# EAGLE design v2164_quad_VCA_0402 (EAGLE 7.7.0)
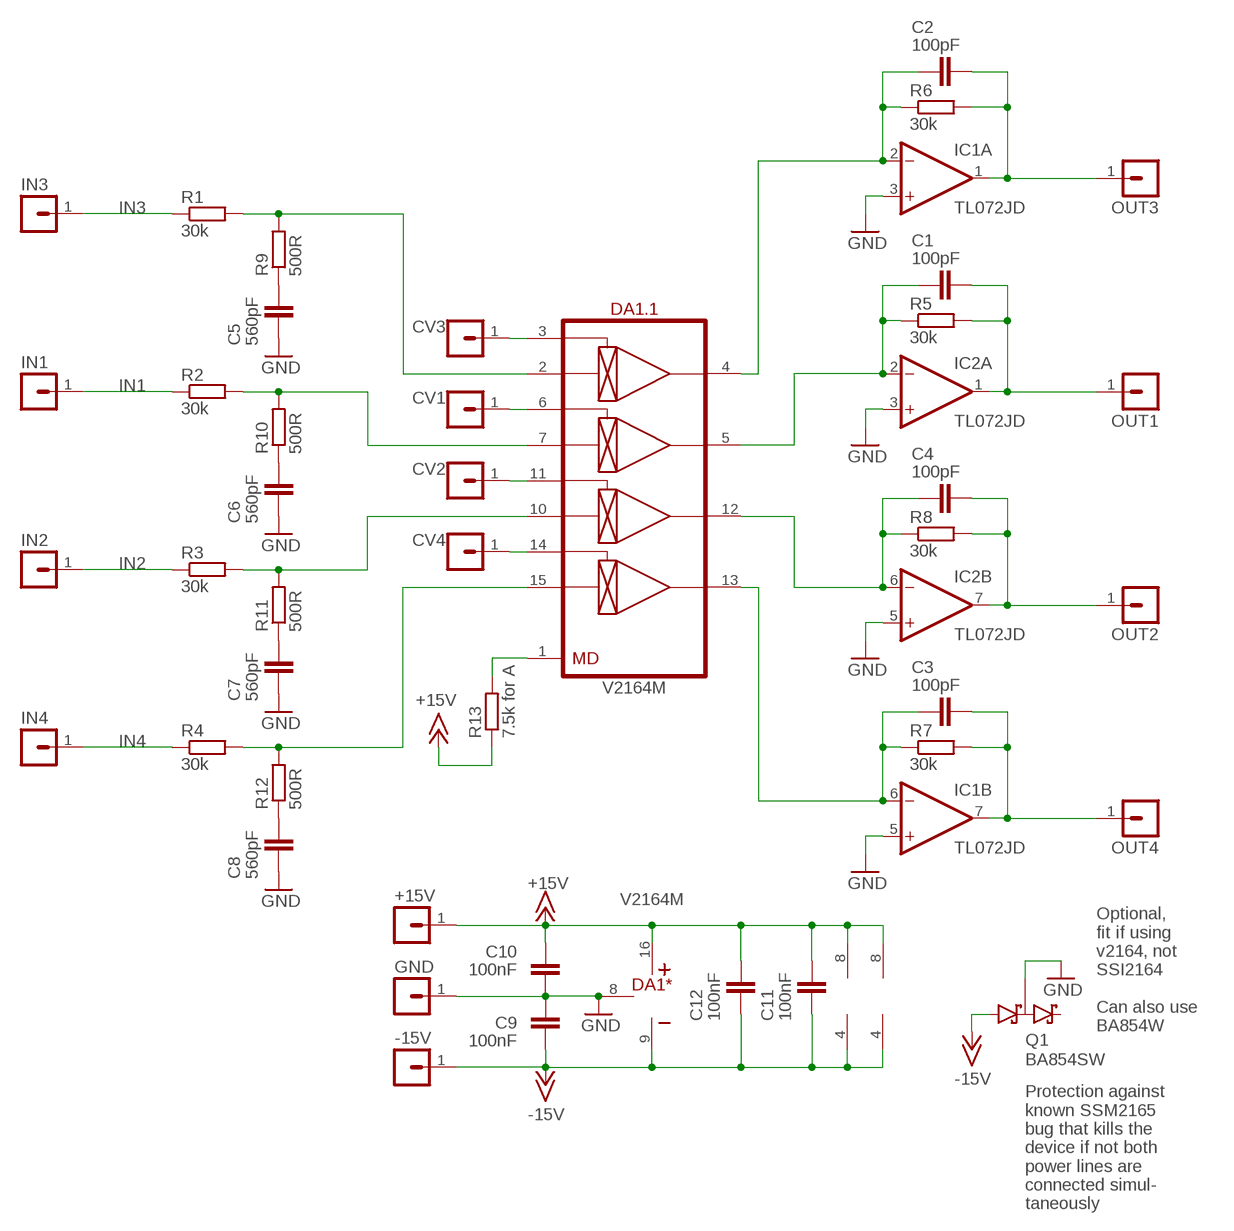
[diagram p0: schematic, sheet 1]

## Parts
+15V  MA01-1JN  [MA01N-1J]
-15V  MA01-1JN  [MA01N-1J]
C1  100pF  C-EUC0402  [C0402]
C2  100pF  C-EUC0402  [C0402]
C3  100pF  C-EUC0402  [C0402]
C4  100pF  C-EUC0402  [C0402]
C5  560pF  C-EUC0603  [C0603]
C6  560pF  C-EUC0603  [C0603]
C7  560pF  C-EUC0603  [C0603]
C8  560pF  C-EUC0603  [C0603]
C9  100nF  C-EUC0402  [C0402]
C10  100nF  C-EUC0402  [C0402]
C11  100nF  C-EUC0402  [C0402]
C12  100nF  C-EUC0402  [C0402]
CV1  MA01-1JN  [MA01N-1J]
CV2  MA01-1JN  [MA01N-1J]
CV3  MA01-1JN  [MA01N-1J]
CV4  MA01-1JN  [MA01N-1J]
DA1  V2164M  [SO-16]
GND  MA01-1JN  [MA01N-1J]
IC1  TL072JD  [SO08J]
IC2  TL072JD  [SO08J]
IN1  MA01-1JN  [MA01N-1J]
IN2  MA01-1JN  [MA01N-1J]
IN3  MA01-1JN  [MA01N-1J]
IN4  MA01-1JN  [MA01N-1J]
OUT1  MA01-1JN  [MA01N-1J]
OUT2  MA01-1JN  [MA01N-1J]
OUT3  MA01-1JN  [MA01N-1J]
OUT4  MA01-1JN  [MA01N-1J]
Q1  BA854SW  [SOT23-3J]
R1  30k  R-EU_R0402  [R0402]
R2  30k  R-EU_R0402  [R0402]
R3  30k  R-EU_R0402  [R0402]
R4  30k  R-EU_R0402  [R0402]
R5  30k  R-EU_R0402  [R0402]
R6  30k  R-EU_R0402  [R0402]
R7  30k  R-EU_R0402  [R0402]
R8  30k  R-EU_R0402  [R0402]
R9  500R  R-EU_R0402  [R0402]
R10  500R  R-EU_R0402  [R0402]
R11  500R  R-EU_R0402  [R0402]
R12  500R  R-EU_R0402  [R0402]
R13  7.5k for A  R-EU_R0402  [R0402]

## Nets
+15V: +15V.1 C10.2 C11.2 C12.2 DA1.16(*:V+) IC1.8(P:V+) IC2.8(P:V+) R13.1
-15V: -15V.1 C9.1 C11.1 C12.1 DA1.9(*:V-) IC1.4(P:V-) IC2.4(P:V-) Q1.1(A1)
CV1: CV1.1 DA1.6(.1:CV2)
CV2: CV2.1 DA1.11(.1:CV3)
CV3: CV3.1 DA1.3(.1:CV1)
CV4: CV4.1 DA1.14(.1:CV4)
GND: C5.1 C6.1 C7.1 C8.1 C9.2 C10.1 DA1.8(*:GND) GND.1 IC1.3(A:+IN) IC1.5(B:+IN) IC2.3(A:+IN) IC2.5(B:+IN) Q1.3(K1A2)
IN1: IN1.1 R2.1
IN2: IN2.1 R3.1
IN3: IN3.1 R1.1
IN4: IN4.1 R4.1
N$1: C4.1 DA1.12(.1:OUT3) IC2.6(B:-IN) R8.1
N$2: DA1.1(.1:MD) R13.2
N$3: C3.1 DA1.13(.1:OUT4) IC1.6(B:-IN) R7.1
N$5: C2.1 DA1.4(.1:OUT1) IC1.2(A:-IN) R6.1
N$7: C1.1 DA1.5(.1:OUT2) IC2.2(A:-IN) R5.1
N$9: C5.2 R9.1
N$10: C6.2 R10.1
N$11: C7.2 R11.1
N$12: C8.2 R12.1
N$17: DA1.2(.1:IN1) R1.2 R9.2
N$18: DA1.7(.1:IN2) R2.2 R10.2
N$19: DA1.10(.1:IN3) R3.2 R11.2
N$20: DA1.15(.1:IN4) R4.2 R12.2
OUT1: C1.2 IC2.1(A:OUT) OUT1.1 R5.2
OUT2: C4.2 IC2.7(B:OUT) OUT2.1 R8.2
OUT3: C2.2 IC1.1(A:OUT) OUT3.1 R6.2
OUT4: C3.2 IC1.7(B:OUT) OUT4.1 R7.2
Unconnected: Q1.2(K2)

## Notes on the sheet
- Optional,
  fit if using
  v2164, not
  SSI2164
  
  Can also use
  BA854W
- Protection against
  known SSM2165
  bug that kills the
  device if not both
  power lines are 
  connected simul-
  taneously

## Library data of the parts
+15V -15V CV1-CV4 GND IN1-IN4 OUT1-OUT4 = joakim:MA01-1J: PIN HEADER
C1-C12 = rcl:C-EU: CAPACITOR, European symbol; SPICEPREFIX: C
DA1 = ic-coolaudio:V2164
IC1 IC2 = joakim:TL072J: OP AMP
Q1 = joakim:BA854SW: Shottky barrier dual diode
R1-R13 = rcl:R-EU_: RESISTOR, European symbol; SPICEPREFIX: R

## Board
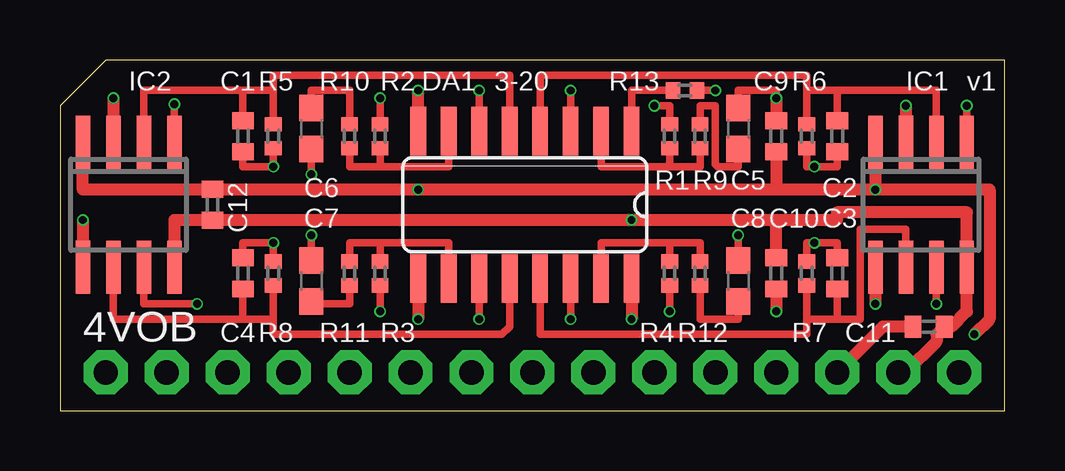
[diagram p1: board, top side]
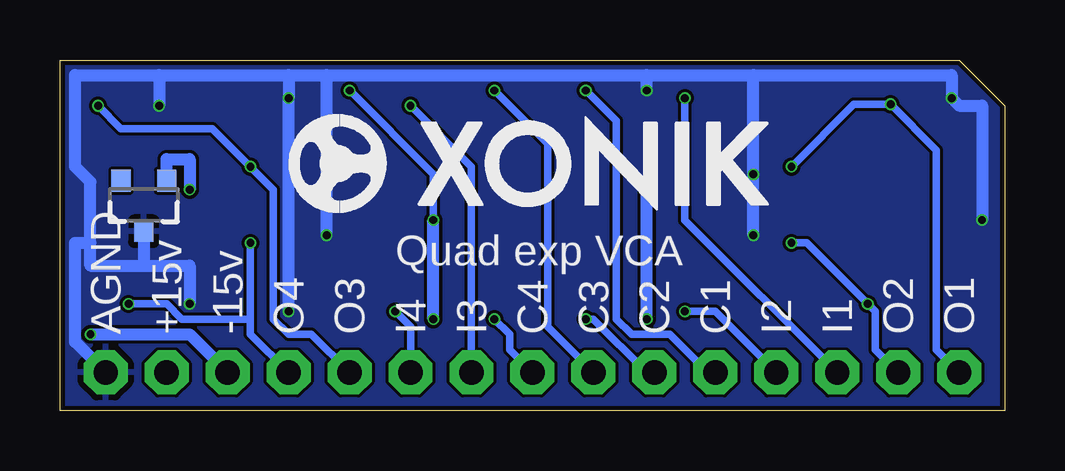
[diagram p2: board, bottom side, seen from below]

Size 39.37 x 14.61 mm. Coordinates in mm from the lower left corner, seen from the top.
Outline: 0,0 39.37,0 39.37,14.61 1.91,14.61 0,12.7 0,0
Copper layers (1*16): Top 0.035mm / dielectric 1.6mm / Bottom 0.035mm
Design rules "jlcpcb-2layers": minimum track width 5mil, minimum drill 0.3mm, track to track 5mil, track to pad 5mil, pad to pad 5mil, via to via 5mil, smd to smd 5mil, copper to edge 0.2mm, drill to drill 6mil, minimum pad ring 10mil, minimum via ring 3mil, stop-mask expansion 4mil, vias tented up to drill 0mil, thermal gap 10mil

### Footprints (pad centres in the part's own frame; a part is rotated, then mirrored left to right if it is on the bottom)
MA01N-1J = drill 1.016 octagon: 1 0,0
C0402 = smd 0.7 x 0.9: 1 -0.65,0; 2 0.65,0
C0603 = smd 1.1 x 1: 1 -0.85,0; 2 0.85,0
SO-16 = smd 0.66 x 2.032: 1 -4.445,-3.073; 2 -3.175,-3.073; 3 -1.905,-3.073; 4 -0.635,-3.073; 5 0.635,-3.073; 6 1.905,-3.073; 7 3.175,-3.073; 8 4.445,-3.073; 9 4.445,3.073; 10 3.175,3.073; 11 1.905,3.073; 12 0.635,3.073; 13 -0.635,3.073; 14 -1.905,3.073; 15 -3.175,3.073; 16 -4.445,3.073
SO08J = smd 0.6 x 2.2: 1 -1.905,-2.6; 2 -0.635,-2.6; 3 0.635,-2.6; 4 1.905,-2.6; 5 1.905,2.6; 6 0.635,2.6; 7 -0.635,2.6; 8 -1.905,2.6
SOT23-3J = smd 0.8 x 0.9: 1 -0.95,-1; 2 0.95,-1; 3 0,1.1
R0402 = smd 0.6 x 0.7: 1 -0.5,0; 2 0.5,0

### Placement (x,y rotation side)
+15V  34.92,1.59 90 top
-15V  32.38,1.59 90 top
C1  7.62,11.43 270 top
C2  32.38,11.43 270 top
C3  32.38,5.71 90 top
C4  7.62,5.71 90 top
C5  28.26,11.75 270 top
C6  10.48,11.75 90 top
C7  10.48,5.4 270 top
C8  28.26,5.4 270 top
C9  29.84,11.43 90 top
C10  29.84,5.71 90 top
C11  36.2,3.49 0 top
C12  6.35,8.57 270 top
CV1  12.06,1.59 90 top
CV2  14.61,1.59 90 top
CV3  17.14,1.59 90 top
CV4  19.68,1.59 90 top
DA1  19.37,8.57 180 top
GND  37.47,1.59 90 top
IC1  35.88,8.57 180 top
IC2  2.86,8.57 180 top
IN1  6.99,1.59 90 top
IN2  9.53,1.59 90 top
IN3  22.23,1.59 90 top
IN4  24.77,1.59 90 top
OUT1  1.91,1.59 90 top
OUT2  4.45,1.59 90 top
OUT3  27.3,1.59 90 top
OUT4  29.84,1.59 90 top
Q1  35.88,8.57 180 bottom
R1  25.4,11.43 270 top
R2  13.34,11.43 270 top
R3  13.34,5.71 90 top
R4  25.4,5.71 90 top
R5  8.89,11.43 270 top
R6  31.11,11.43 270 top
R7  31.11,5.71 90 top
R8  8.89,5.71 90 top
R9  26.67,11.43 270 top
R10  12.06,11.43 270 top
R11  12.06,5.71 90 top
R12  26.67,5.71 90 top
R13  26.04,13.34 180 top
U$1  [XONIK_LOGO_20]  29.84,8.26 0 bottom

### Tracks (layer width: path | path; a pad name or v marks a point on that pad's centre or on a via)
+15V  (via drill 0.33)
  Top 0.305: R13.1 v27.3,13.34
  Top 0.508: IC2.8 4.76,7.94 6.35,7.94 | 29.84,7.94 32.38,7.94 32.38,8.26 37.78,8.26 IC1.8 37.78,4.13 37.15,3.49 C11.2 36.53,3.17 36.53,2.87 35.24,1.59 +15V.1 | 29.84,7.94 v23.81,7.94 6.35,7.94 | C12.2 6.35,7.94 | C10.2 29.84,7.94 | DA1.16 v23.81,3.81
  Bottom 0.305: v27.3,13.34 23.81,9.84 v23.81,7.94
  Bottom 0.508: v23.81,3.81 v23.81,7.94
-15V  (via drill 0.33)
  Top 0.508: IC1.4 v33.97,9.21 | IC2.4 0.95,9.21 6.35,9.21 | v33.97,9.21 29.84,9.21 | 29.84,9.21 v14.92,9.21 6.35,9.21 | DA1.9 v14.92,3.81 | C12.1 6.35,9.21 | C9.1 29.84,9.21 | C11.1 34.29,3.49 -15V.1 | v38.1,3.17 38.73,3.81 38.73,9.21 v33.97,9.21
  Bottom 0.508: v14.92,3.81 v14.92,9.21 | v38.1,3.17 33.97,3.17 -15V.1 | Q1.1 34.92,10.48 33.97,10.48 v33.97,9.21
CV1  (via drill 0.33)
  Top 0.305: DA1.6 v17.46,13.34
  Bottom 0.305: v17.46,13.34 16.19,12.06 16.19,3.81 15.56,3.17 13.97,3.17 12.38,1.59 CV1.1
CV2  (via drill 0.33)
  Top 0.305: DA1.11 v17.46,3.81
  Bottom 0.305: v17.46,3.81 17.14,3.81 14.92,1.59 CV2.1
CV3  (via drill 0.33)
  Top 0.305: DA1.3 v21.27,13.34
  Bottom 0.305: v21.27,13.34 19.05,11.11 19.05,3.49 CV3.1
CV4  (via drill 0.33)
  Top 0.305: DA1.14 v21.27,3.81
  Bottom 0.305: v21.27,3.81 20.64,3.17 20.64,2.54 CV4.1
GND  (via drill 0.33)
  Top 0.305: C6.1 v10.48,9.84 | C7.1 v10.48,7.3 | C8.1 v28.26,7.3 | C5.1 28.26,13.34 29.84,13.34 v29.84,13.02
  Top 0.508: DA1.8 v14.92,13.34 | v29.84,13.02 C9.2 | C10.1 v29.84,4.13 | v35.24,12.7 IC1.3 | IC1.5 v33.97,4.45 | v2.22,13.02 IC2.3 | v0.95,7.94 IC2.5
  Bottom 0.508: 35.24,13.97 38.73,13.97 38.73,10.16 38.1,9.53 38.1,6.99 | 35.24,13.97 29.84,13.97 | 29.84,13.97 28.26,13.97 | 28.26,13.97 14.92,13.97 | 14.92,13.97 10.48,13.97 | 10.48,13.97 2.22,13.97 v2.22,13.02 1.91,12.7 0.95,12.7 v0.95,7.94 | v14.92,13.34 14.92,13.97 | 29.84,13.97 v29.84,13.02 v29.84,4.13 | 35.24,13.97 v35.24,12.7 | 10.48,13.97 v10.48,9.84 v10.48,7.3 | v28.26,7.3 28.26,13.97 | 35.88,6.03 38.1,6.03 38.1,6.99 | 35.88,6.03 33.97,6.03 v33.97,4.45 | GND.1 38.73,2.86 38.73,6.99 38.1,6.99 | Q1.3 35.88,6.03
  pour Bottom: 0,0 0,14.61 39.37,14.61 39.37,0
IN1  (via drill 0.33)
  Top 0.305: R2.1 v13.34,13.02
  Bottom 0.305: v13.34,13.02 13.34,7.94 IN1.1
IN2  (via drill 0.33)
  Top 0.305: R3.1 v13.34,4.13
  Bottom 0.305: v13.34,4.13 12.06,4.13 IN2.1
IN3  (via drill 0.33)
  Top 0.305: v24.77,12.7 25.4,12.7 R1.1
  Bottom 0.305: v24.77,12.7 22.23,10.16 IN3.1
IN4  (via drill 0.33)
  Top 0.305: v25.4,4.13 R4.1
  Bottom 0.305: v25.4,4.13 24.77,3.49 IN4.1
N$1
  Top 0.305: R8.1 8.89,3.81 | 8.89,3.81 7.62,3.81 | C4.1 7.62,3.81 | IC2.6 2.22,3.81 7.62,3.81 | DA1.12 18.73,3.49 18.41,3.17 8.89,3.17 8.89,3.81
N$2
  Top 0.305: R13.2 23.81,13.34 DA1.1
N$3
  Top 0.305: R7.1 31.11,3.81 | 31.11,3.81 32.38,3.81 | 32.38,3.81 33.34,3.81 33.34,7.56 35.24,7.56 IC1.6 | C3.1 32.38,3.81 | DA1.13 20,3.17 31.11,3.17 31.11,3.81
N$5
  Top 0.305: 32.38,13.34 31.11,13.34 | 31.11,13.34 R6.1 | C2.1 32.38,13.34 | IC1.2 36.51,13.34 32.38,13.34 | DA1.4 20,13.97 31.11,13.97 31.11,13.34
N$7
  Top 0.305: C1.1 7.62,13.34 | 7.62,13.34 8.89,13.34 | 8.89,13.34 R5.1 | IC2.2 3.49,13.34 7.62,13.34 | DA1.5 18.73,13.97 8.89,13.97 8.89,13.34
N$9
  Top 0.305: R9.1 26.67,12.7 27.3,12.7 27.3,10.26 27.41,10.16 28.26,10.16 C5.2
N$10
  Top 0.305: C6.2 10.48,13.34 12.06,13.34 R10.1
N$11
  Top 0.305: R11.1 12.06,4.45 10.48,4.45 C7.2
N$12
  Top 0.305: R12.1 26.67,3.81 28.26,3.81 C8.2
N$17
  Top 0.305: DA1.2 22.54,10.16 25.4,10.16 | R9.2 26.67,10.16 25.4,10.16 | 25.4,10.16 R1.2
N$18
  Top 0.305: R10.2 12.06,10.16 13.34,10.16 | 13.34,10.16 R2.2 | 13.34,10.16 16.19,10.16 DA1.7
N$19
  Top 0.305: R11.2 12.06,6.99 13.34,6.99 | 13.34,6.99 R3.2 | DA1.10 16.19,6.99 13.34,6.99
N$20
  Top 0.305: R12.2 26.67,6.99 25.4,6.99 | 25.4,6.99 R4.2 | DA1.15 22.54,6.99 25.4,6.99
OUT1  (via drill 0.33)
  Top 0.305: C1.2 7.62,10.16 v8.89,10.16 R5.2 | IC2.1 v4.76,12.76
  Bottom 0.305: OUT1.1 2.86,2.54 2.86,10.86 v4.76,12.76 6.29,12.76 v8.89,10.16
OUT2  (via drill 0.33)
  Top 0.305: R8.2 v8.89,6.99 7.62,6.99 C4.2 | IC2.7 3.49,4.45 v5.71,4.45
  Bottom 0.305: OUT2.1 5.4,2.54 5.4,4.13 v5.71,4.45 8.26,6.99 v8.89,6.99
OUT3  (via drill 0.33)
  Top 0.305: R6.2 31.11,10.16 v31.43,10.16 32.38,10.16 C2.2 | IC1.1 v37.78,12.7
  Bottom 0.305: v37.78,12.7 36.83,11.75 33.02,11.75 v31.43,10.16 30.48,9.21 30.48,3.81 29.84,3.17 28.89,3.17 OUT3.1
OUT4  (via drill 0.33)
  Top 0.305: R7.2 31.11,6.99 v31.43,6.99 32.38,6.99 C3.2 | IC1.7 v36.51,4.45
  Bottom 0.305: v36.51,4.45 34.92,4.45 34.29,3.81 31.43,3.81 | OUT4.1 31.43,3.17 31.43,3.81 | 31.43,3.81 v31.43,6.99

### Text on the board
tNames: 3-20 | v1 | 4VOB
bNames: Quad exp VCA | O1 | O2 | I1 | I2 | C1 | C2 | C3 | C4 | I3 | I4 | O3 | O4 | -15v | +15v | AGND